# Altium schematic sheet Э3_2.SchDoc: плата
size 420 x 297 mm; DrawnBy: Каверзнев; DocumentNumber: Ремонт Труб; Revision: 1; SheetNumber: 2; SheetTotal: 2; Format: A3
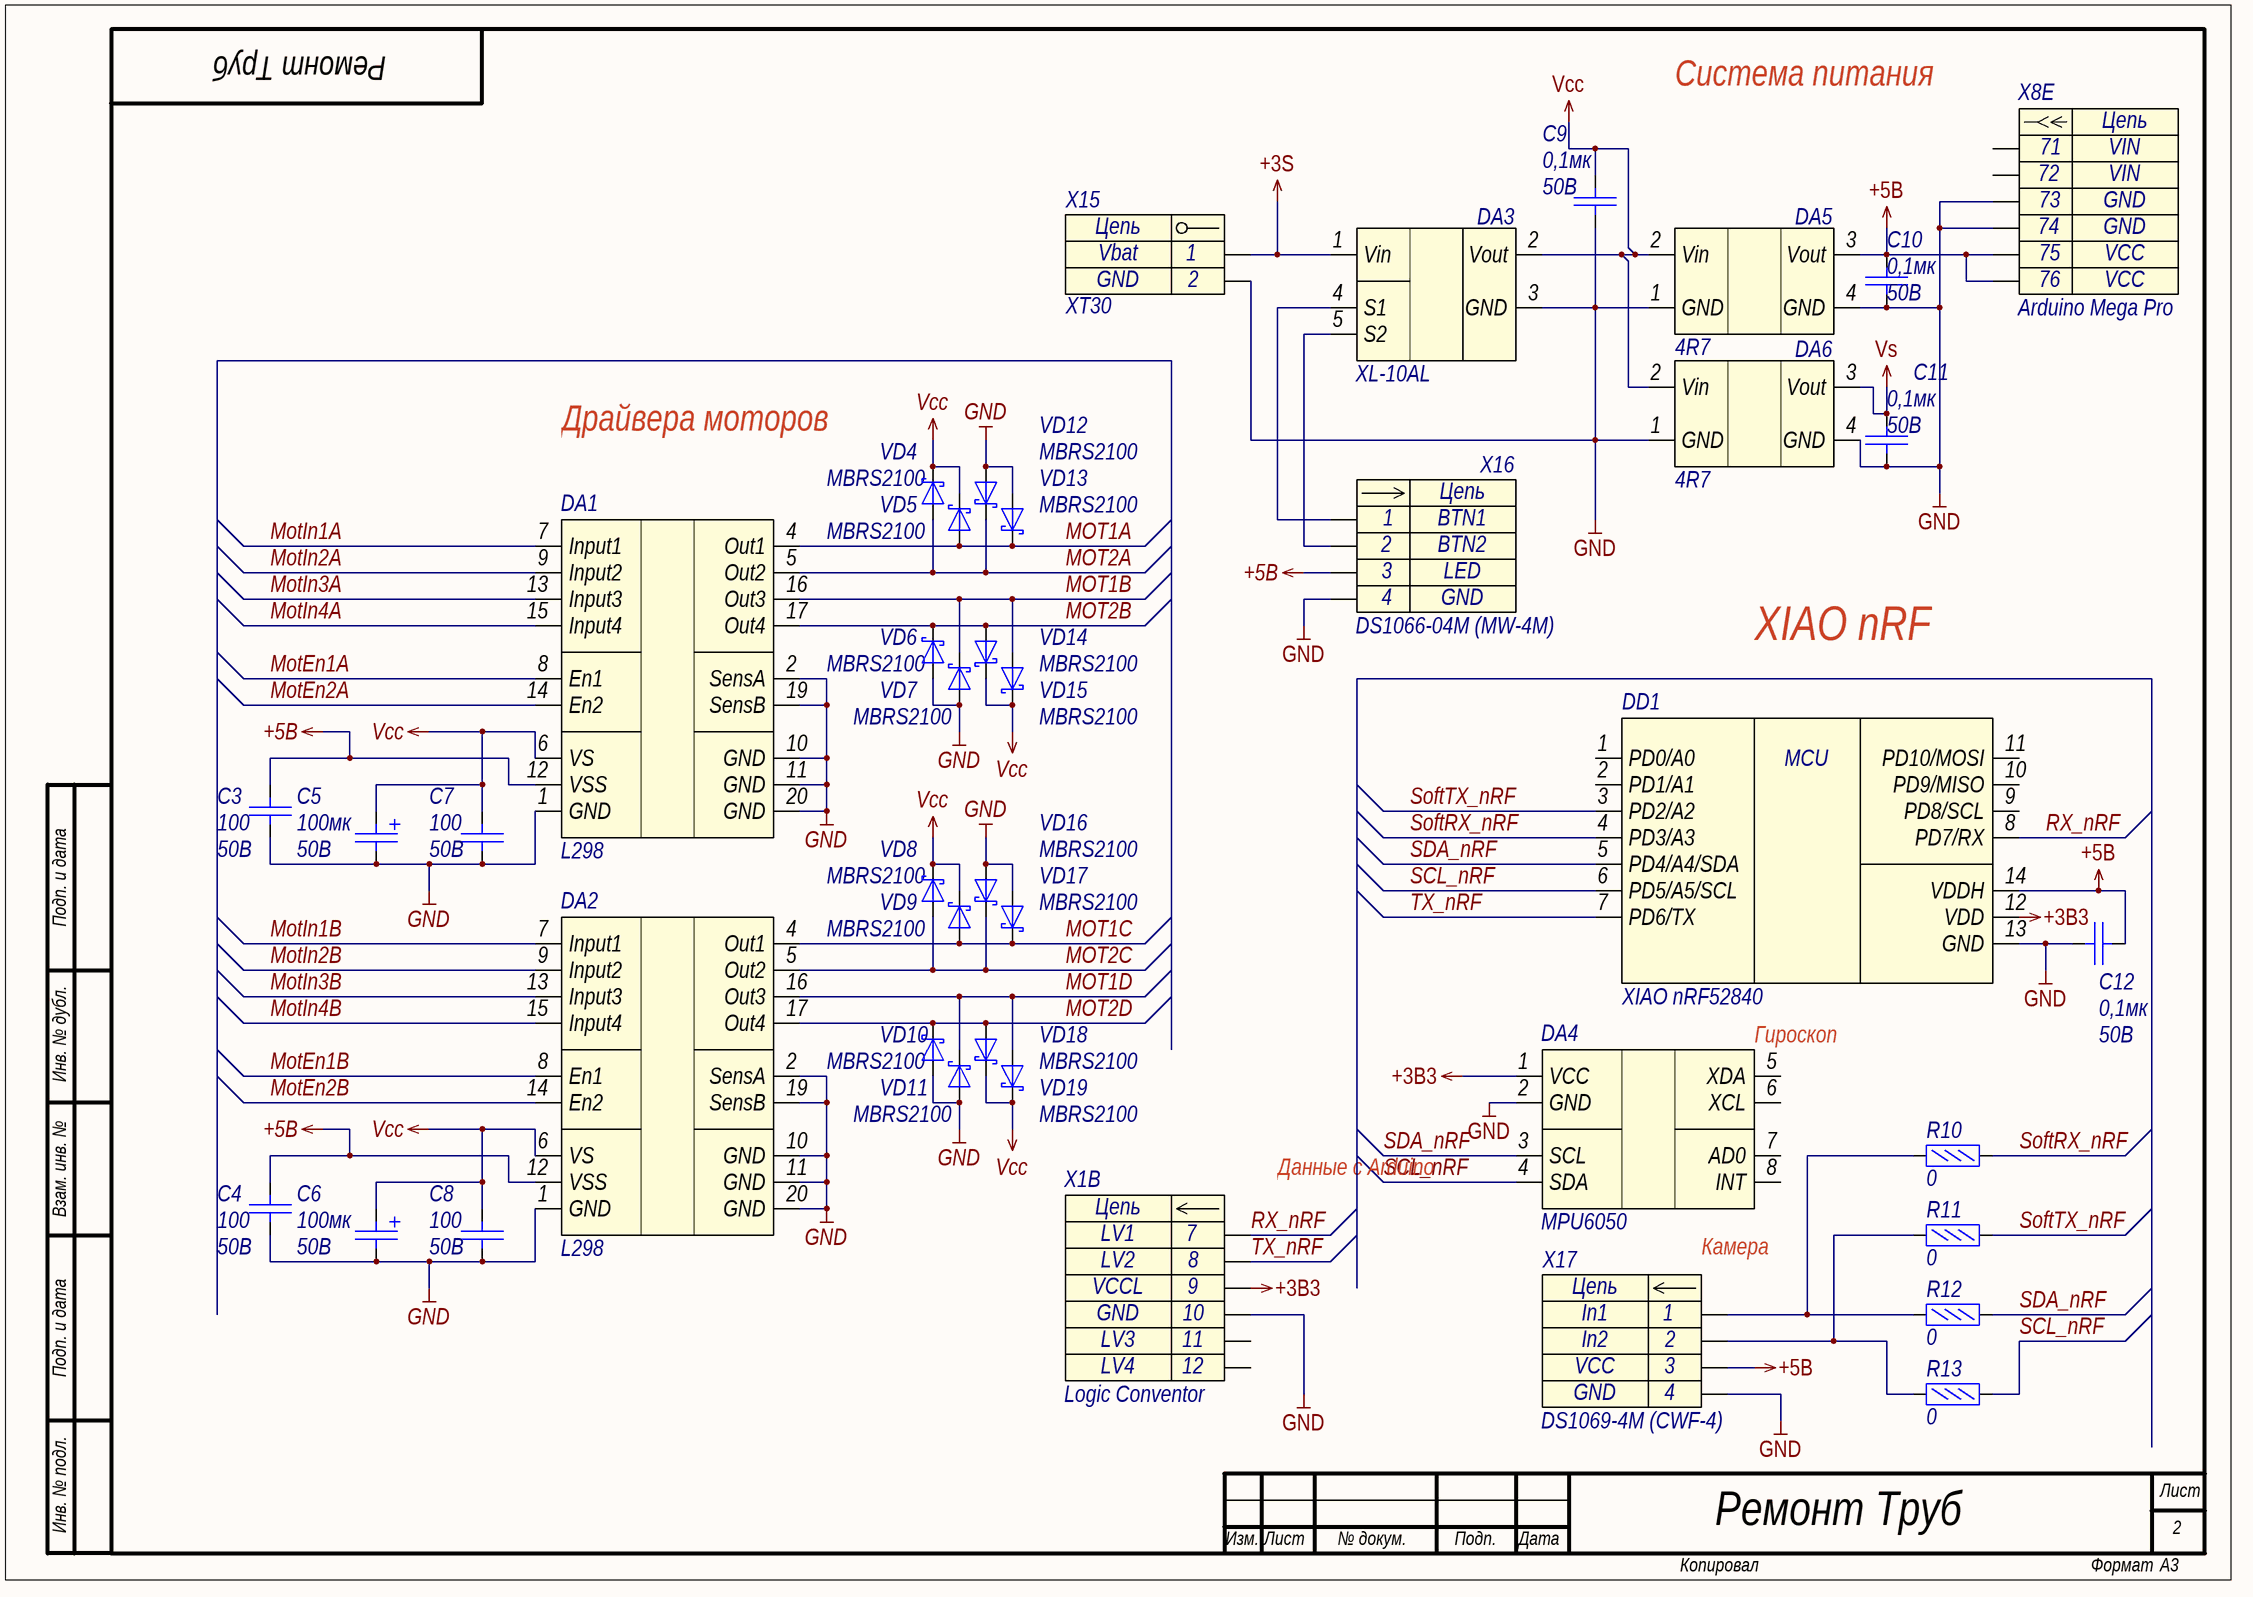
[diagram p0: Э3_2.SchDoc]

## Parts
C3  Voltage: 50В  [C0603]  (hidden comment: 100)
C4  Voltage: 50В  [C0603]  (hidden comment: 100)
C5  Voltage: 50В  [CAPALUM_8x11.5_V]  (hidden comment: 100мк)
C6  Voltage: 50В  [CAPALUM_8x11.5_V]  (hidden comment: 100мк)
C7  Voltage: 50В  [C0603]  (hidden comment: 100)
C8  Voltage: 50В  [C0603]  (hidden comment: 100)
C9  Voltage: 50В  [C0603]  (hidden comment: 0,1мк)
C10  Voltage: 50В  [C0603]  (hidden comment: 0,1мк)
C11  Voltage: 50В  [C0603]  (hidden comment: 0,1мк)
C12  Voltage: 50В  [C0603]  (hidden comment: 0,1мк)
DA1  L298  [L298P]
DA2  L298  [L298P]
DA3  XL-10AL  [XL-10AL]
DA4  MPU6050  [MPU6050]
DA5  4R7  [mini360]
DA6  4R7  [mini360]
DD1  XIAO nRF52840  [Seeed Studio XIAO nRF52840]
R10  0  [R0603]
R11  0  [R0603]
R12  0  [R0603]
R13  0  [R0603]
VD4  MBRS2100  [DO-214AA]
VD5  MBRS2100  [DO-214AA]
VD6  MBRS2100  [DO-214AA]
VD7  MBRS2100  [DO-214AA]
VD8  MBRS2100  [DO-214AA]
VD9  MBRS2100  [DO-214AA]
VD10  MBRS2100  [DO-214AA]
VD11  MBRS2100  [DO-214AA]
VD12  MBRS2100  [DO-214AA]
VD13  MBRS2100  [DO-214AA]
VD14  MBRS2100  [DO-214AA]
VD15  MBRS2100  [DO-214AA]
VD16  MBRS2100  [DO-214AA]
VD17  MBRS2100  [DO-214AA]
VD18  MBRS2100  [DO-214AA]
VD19  MBRS2100  [DO-214AA]
X1  Logic Conventor  [LOGIC CONVENTOR]  (part B of 2)
X8  Arduino Mega Pro  [Arduino Mega Pro Mini]  (part E of 5)
X15  XT30  [XT30 - duplicate]
X16  DS1066-04M (MW-4M)  [MW-4M]
X17  DS1069-4M (CWF-4)  [CWF-4]

## Nets
+3B3: DA4.1(VCC) DD1.12(VDD) X1.9
+3S: DA3.1(Vin) X15.1
+5B: C3.1 C4.1 C10.2 C12.2 DA1.12(VSS) DA2.12(VSS) DA5.3(Vout) DD1.14(VDDH) X8.75 X8.76 X16.3 X17.3
GND: C3.2 C4.2 C5.2 C6.2 C7.1 C8.1 C9.1 C10.1 C11.1 C12.1 DA1.1(GND) DA1.2(SensA) DA1.10(GND) DA1.11(GND) DA1.19(SensB) DA1.20(GND) DA2.1(GND) DA2.2(SensA) DA2.10(GND) DA2.11(GND) DA2.19(SensB) DA2.20(GND) DA3.3(GND) DA4.2(GND) DA5.1(GND) DA5.4(GND) DA6.1(GND) DA6.4(GND) DD1.13(GND) VD6.2(A) VD7.2(A) VD10.2(A) VD11.2(A) VD12.2(A) VD13.2(A) VD16.2(A) VD17.2(A) X1.10 X8.73 X8.74 X15.2 X16.4 X17.4
Vcc: C5.1 C6.1 C7.2 C8.2 C9.2 DA1.6(VS) DA2.6(VS) DA3.2(Vout) DA5.2(Vin) DA6.2(Vin) VD4.1(K) VD5.1(K) VD8.1(K) VD9.1(K) VD14.1(K) VD15.1(K) VD18.1(K) VD19.1(K)
Vs: C11.2 DA6.3(Vout)
MOT1A: DA1.4(Out1) VD5.2(A) VD13.1(K)
MOT1B: DA1.16(Out3) VD7.1(K) VD15.2(A)
MOT1C: DA2.4(Out1) VD9.2(A) VD17.1(K)
MOT1D: DA2.16(Out3) VD11.1(K) VD19.2(A)
MOT2A: DA1.5(Out2) VD4.2(A) VD12.1(K)
MOT2B: DA1.17(Out4) VD6.1(K) VD14.2(A)
MOT2C: DA2.5(Out2) VD8.2(A) VD16.1(K)
MOT2D: DA2.17(Out4) VD10.1(K) VD18.2(A)
MotEn1A: DA1.8(En1)
MotEn1B: DA2.8(En1)
MotEn2A: DA1.14(En2)
MotEn2B: DA2.14(En2)
MotIn1A: DA1.7(Input1)
MotIn1B: DA2.7(Input1)
MotIn2A: DA1.9(Input2)
MotIn2B: DA2.9(Input2)
MotIn3A: DA1.13(Input3)
MotIn3B: DA2.13(Input3)
MotIn4A: DA1.15(Input4)
MotIn4B: DA2.15(Input4)
RX_nRF: DD1.8(PD7/RX) X1.7
SCL_nRF: DA4.4(SDA) DD1.6(PD5/A5/SCL) R13.2
SDA_nRF: DA4.3(SCL) DD1.5(PD4/A4/SDA) R12.2
SoftRX_nRF: DD1.4(PD3/A3) R10.2
SoftTX_nRF: DD1.3(PD2/A2) R11.2
TX_nRF: DD1.7(PD6/TX) X1.8
NetDA3_4: DA3.4(S1) X16.1
NetDA3_5: DA3.5(S2) X16.2
NetR10_1: R10.1 R12.1 X17.1
NetR11_1: R11.1 R13.1 X17.2

Not connected (* = marked no-connect by the designer): DA4 5(XDA) 6(XCL) 7(AD0) 8(INT); DD1 1(PD0/A0) 2(PD1/A1) 9(PD8/SCL) 10(PD9/MISO) 11(PD10/MOSI); X1 11 12; X8 71 72

## Notes on the sheet
- Система питания
- Драйвера моторов
- XIAO nRF
- Подп. и дата
- Инв. № дубл.
- (near DA4) Гироскоп
- Взам. инв. №
- (near X1) Данные с Arduino
- Камера
- Инв. № подл.
- Лист
- 2
- Изм.
- № докум.
- Подп.
- Дата
- Копировал
- Формат
- (in symbol Arduino Mega Pro Mini, part E) Цепь; VIN; GND; VCC
- (in symbol CWF-4) Цепь
- (in symbol Logic Conventor, part B) Цепь; LV1; LV2; VCCL; GND; LV3; LV4
- (in symbol MW-4M) Цепь
- (in symbol XIAO nRF52840) MCU
- (in symbol XT30) Цепь

## Library data of the parts
C3 C4 C7 C8 = CC0603JRNPO9BN101: Конденсатор кер. 100пФ 50В; Manufacturer: Yageo; TKE: NP0; Name: CC0603JRNPO9BN101; Value: 100
C5 C6 = B41858C6107M: Конденсатор эл.лит. алюм. 100мкФ 50В; Manufacturer: EPCOS; ESR: 0,6Ом; Name: B41858C6107; Value: 100мк
C9-C12 = GRM188R71H104KA93D: Конденсатор кер. 0,1мкФ 50В X7R; Manufacturer: Murata; Name: GRM188R71H104KA93D; TKE: X7R; Value: 0,1мк
DA1 DA2 = L298: Драйвер двигателя; Manufacturer: China; Name: L298
DA3 = XL-10AL: Manufacturer: China; Name: XL-10AL
DA4 = MPU6050: Гироскоп и акселерометр; Manufacturer: China; Name: MPU6050
DA5 DA6 = 4R7: Линейный стабилизатор напряжения 14.4В -> 5В; Manufacturer: China; Name: 4R7
DD1 = XIAO nRF52840: Микроконтроллер nRF52840; Name: XIAO nRF52840; HelpURL: https://wiki.seeedstudio.com/XIAO_BLE/#hardware-overview
R10-R13 = Перемычка 0603: Name: Перемычка 0603; Value: 0
VD4-VD19 = MBRS2100: Диод Шоттки 100В 2А; Name: MBRS2100
X1 = Logic Conventor: Преобразователь уровней; Name: Logic Conventor
X8 = Arduino Mega Pro Mini: Name: Arduino Mega Pro
X15 = XT30: Contact_1: Vbat; Contact_2: GND; Name: XT30
X16 = MW-4M: Разъем - 4 конт. прямая вилка на плату; Contact_1: BTN1; Contact_2: BTN2; Contact_3: LED; Contact_4: GND; Name: DS1066-04M (MW-4M)
X17 = CWF-4: Разъем - 4 конт. прямая вилка на плату; Contact_1: In1; Contact_2: In2; Contact_3: VCC; Contact_4: GND; Name: DS1069-4M (CWF-4)